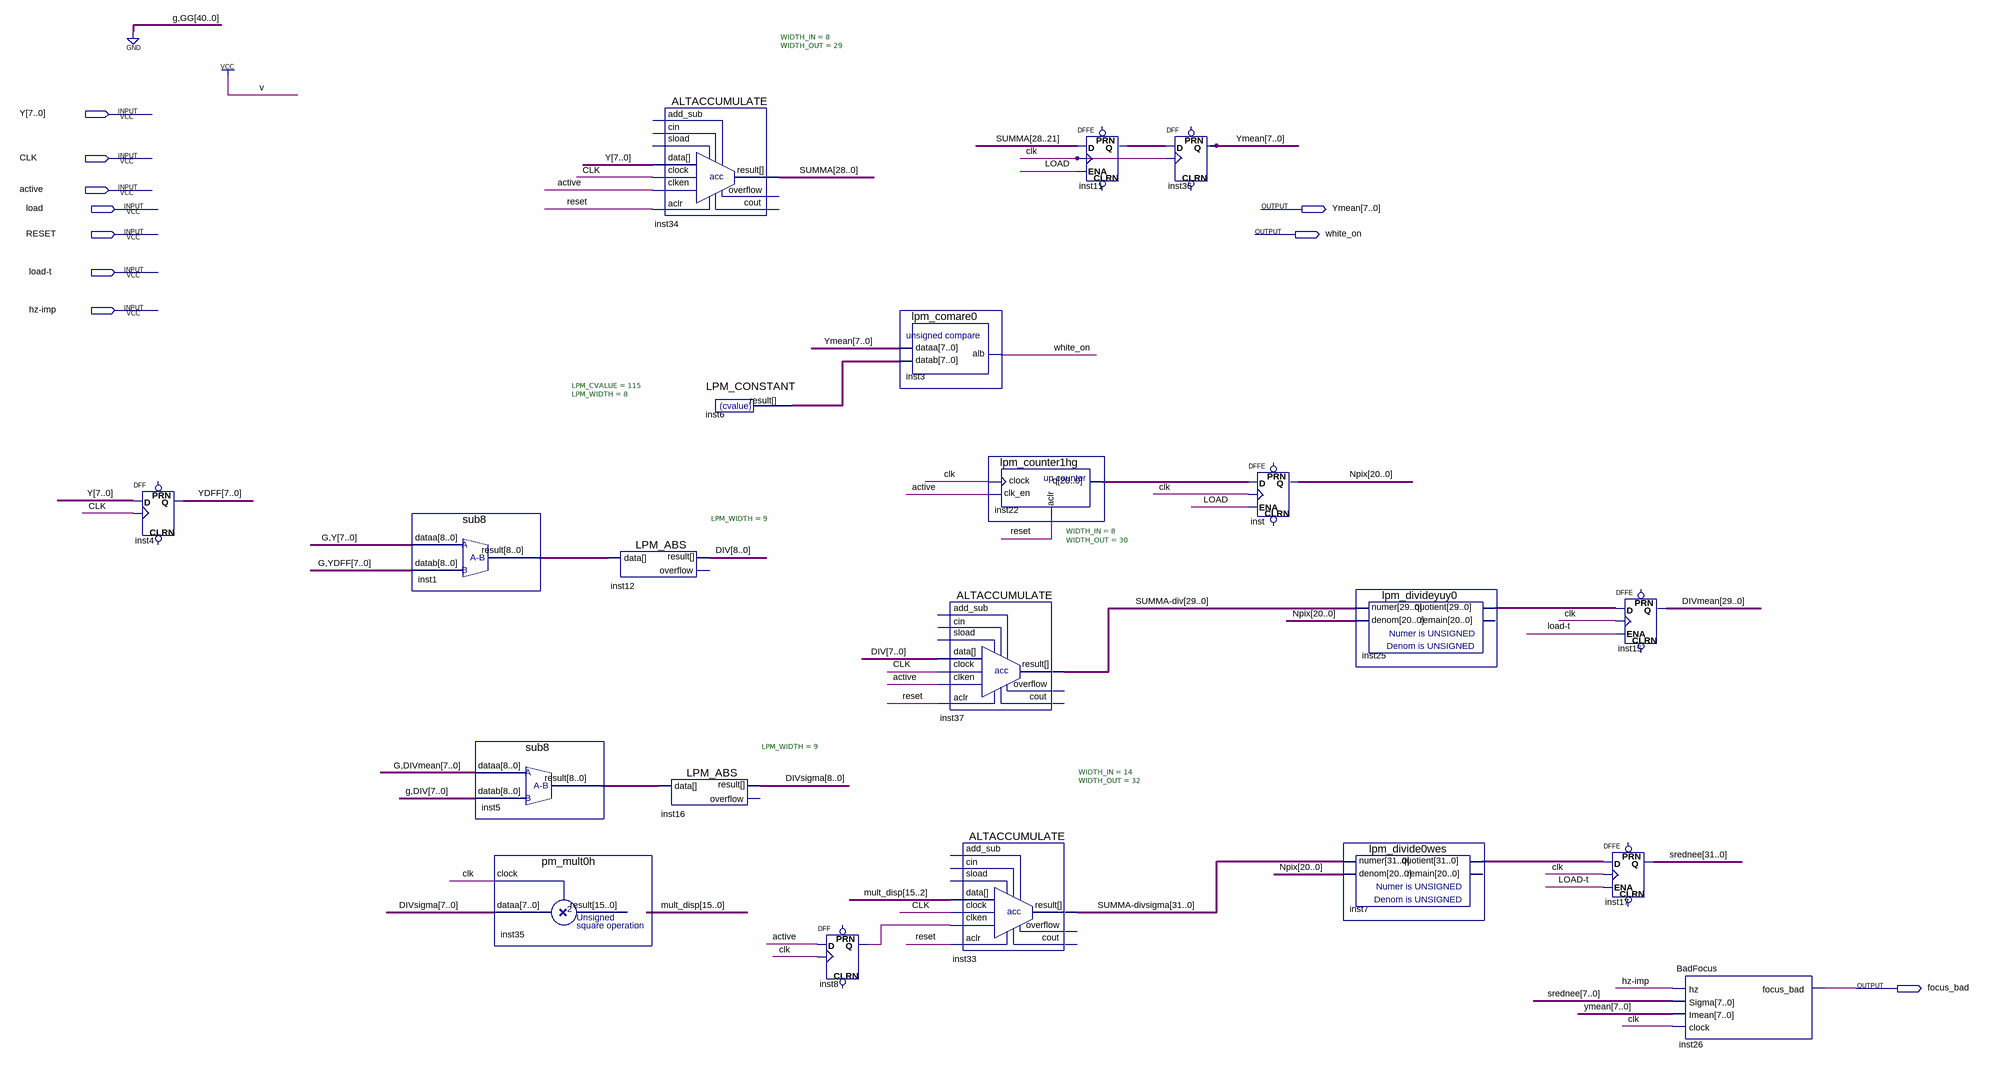
[diagram p0: schematic sheet]
// Quartus schematic Ymean_new.bdf as structural Verilog: 21 symbols, 10 pins
module Ymean_new (
  input  [7:0] Y,
  input  CLK,
  input  active,
  input  load,
  input  RESET,
  input  \load-t ,
  input  \hz-imp ,
  output [7:0] Ymean,
  output white_on,
  output focus_bad
);

  wire inst8_q;
  wire [7:0] inst6_result, inst11_q, YDFF;
  wire [8:0] DIV, DIVsigma, inst1_result, inst5_result;
  wire [15:0] mult_disp;
  wire [20:0] inst22_q, Npix;
  wire [28:0] SUMMA;
  wire [29:0] DIVmean, inst25_quotient, \SUMMA-div ;
  wire [31:0] inst7_quotient, srednee, \SUMMA-divsigma ;

  DFF inst4[7:0] (.CLK(CLK), .D(Y), .Q(YDFF));  // open: CLRN, PRN
  sub8 inst1 (.dataa({1'b0, Y}), .datab({1'b0, YDFF}), .result(inst1_result));
  sub8 inst5 (.dataa({1'b0, DIVmean[7:0]}), .datab({1'b0, DIV[7:0]}), .result(inst5_result));
  pm_mult0h inst35 (.clock(CLK), .dataa(DIVsigma[7:0]), .result(mult_disp));
  LPM_ABS #(.LPM_WIDTH(9)) inst12 (.data(inst1_result), .result(DIV));  // open: overflow
  ALTACCUMULATE #(.WIDTH_IN(8), .WIDTH_OUT(29)) inst34 (
    .aclr(RESET), .clock(CLK), .clken(active), .data(Y), .result(SUMMA));  // open: add_sub, cin, sload, cout, overflow
  LPM_ABS #(.LPM_WIDTH(9)) inst16 (.data(inst5_result), .result(DIVsigma));  // open: overflow
  LPM_CONSTANT #(.LPM_CVALUE(115), .LPM_WIDTH(8)) inst6 (.result(inst6_result));
  DFF inst8 (.CLK(CLK), .D(active), .Q(inst8_q));  // open: CLRN, PRN
  lpm_comare0 inst3 (.dataa(Ymean), .datab(inst6_result), .alb(white_on));
  ALTACCUMULATE #(.WIDTH_IN(8), .WIDTH_OUT(30)) inst37 (
    .aclr(RESET), .clock(CLK), .clken(active), .data(DIV[7:0]), .result(\SUMMA-div ));  // open: add_sub, cin, sload, cout, overflow
  lpm_counter1hg inst22 (.clock(CLK), .clk_en(active), .aclr(RESET), .q(inst22_q));
  ALTACCUMULATE #(.WIDTH_IN(14), .WIDTH_OUT(32)) inst33 (
    .aclr(RESET), .clock(CLK), .clken(inst8_q), .data(mult_disp[15:2]), .result(\SUMMA-divsigma ));  // open: add_sub, cin, sload, cout, overflow
  DFFE inst11[7:0] (.D(SUMMA[28:21]), .CLK(CLK), .ENA(load), .Q(inst11_q));  // open: PRN, CLRN
  DFF inst36[7:0] (.CLK(CLK), .D(inst11_q), .Q(Ymean));  // open: CLRN, PRN
  DFFE inst[20:0] (.D(inst22_q), .CLK(CLK), .ENA(load), .Q(Npix));  // open: PRN, CLRN
  lpm_divide0wes inst7 (.numer(\SUMMA-divsigma ), .denom(Npix), .quotient(inst7_quotient));  // open: remain
  lpm_divideyuy0 inst25 (.numer(\SUMMA-div ), .denom(Npix), .quotient(inst25_quotient));  // open: remain
  DFFE inst15[29:0] (.D(inst25_quotient), .CLK(CLK), .ENA(\load-t ), .Q(DIVmean));  // open: PRN, CLRN
  DFFE inst17[31:0] (.D(inst7_quotient), .CLK(CLK), .ENA(\load-t ), .Q(srednee));  // open: PRN, CLRN
  BadFocus inst26 (.hz(\hz-imp ), .Sigma(srednee[7:0]), .Imean(Ymean), .clock(CLK), .focus_bad(focus_bad));
endmodule
